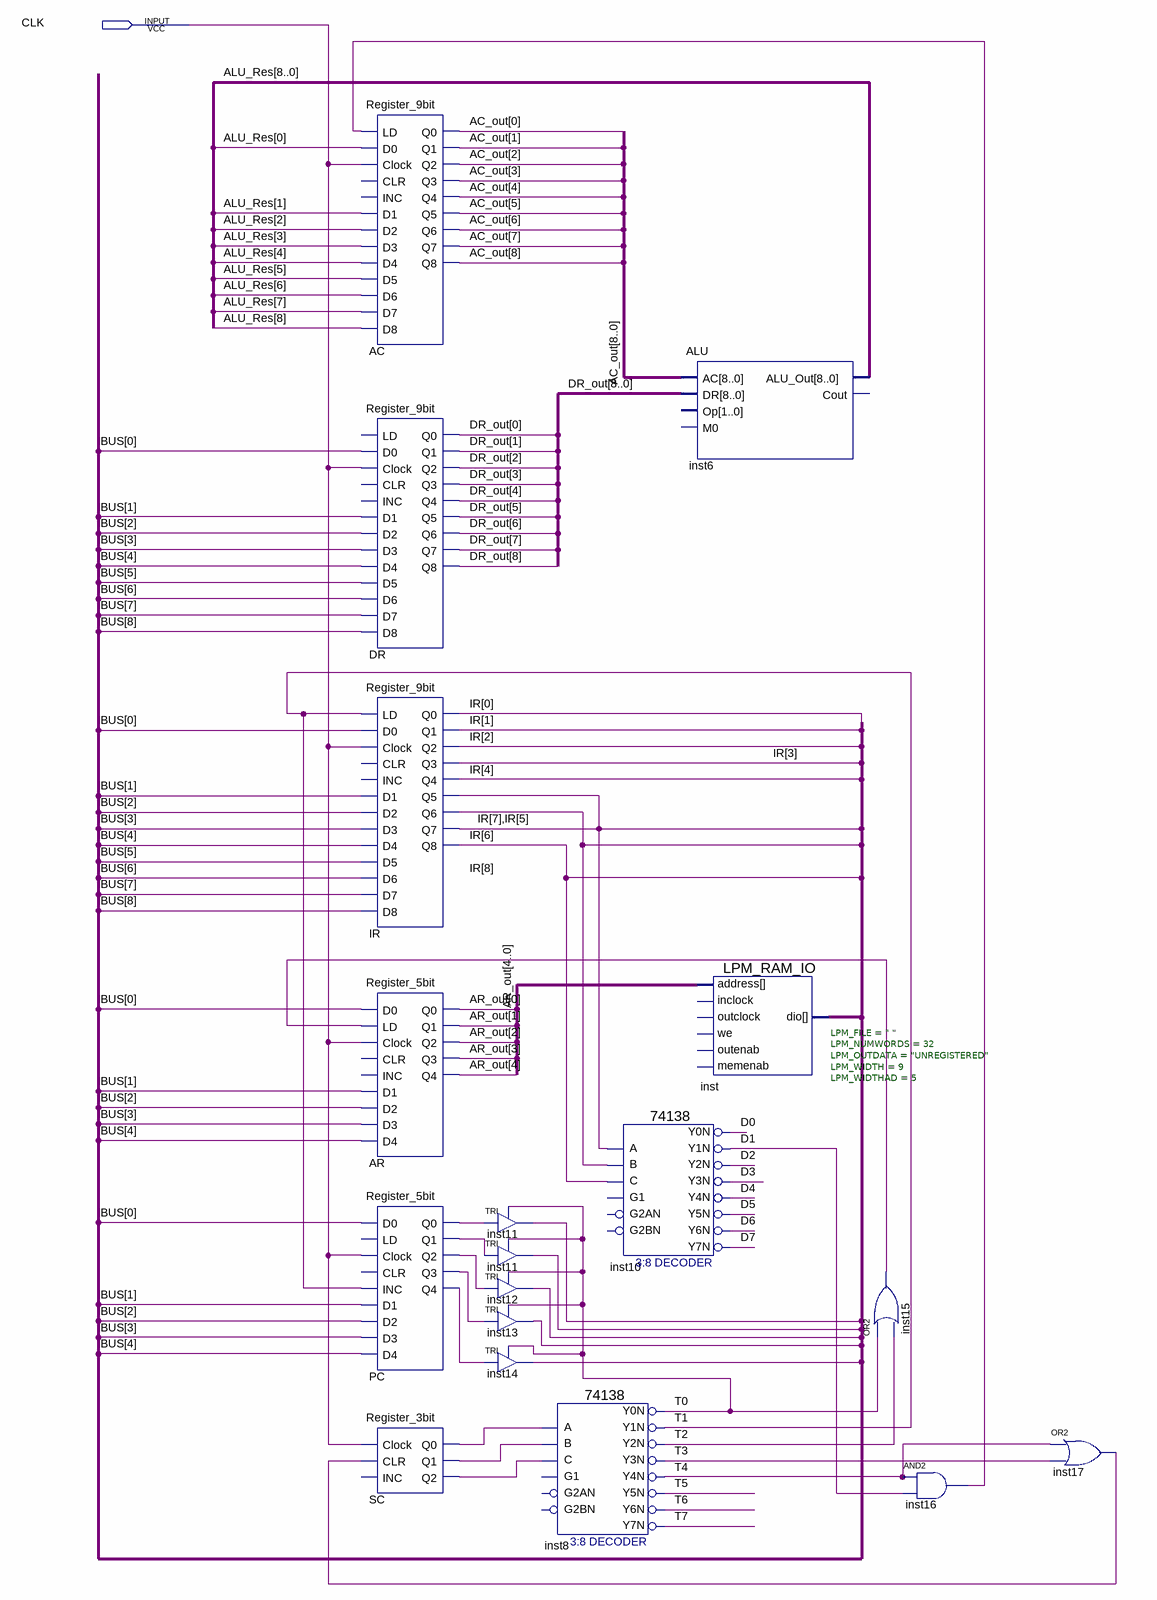
[diagram p0: schematic sheet]
// Quartus schematic MYB.bdf as structural Verilog: 18 symbols, 1 pins
module MYB (
  input  CLK
);

  wire D0, D1, D2, D3, D4, D5, D6, D7, inst11_out, inst11_out_2, inst12_out, inst13_out, inst14_out,
       inst15_out, inst16_out, inst17_out, PC_q0, PC_q1, PC_q2, PC_q3, PC_q4, SC_q0, SC_q1, SC_q2, T0, T1,
       T2, T3, T4, T5, T6, T7;
  wire [4:0] AR_out;
  wire [8:0] AC_out, ALU_Res, BUS, DR_out, inst_dio, IR;

  Register_9bit AC (
    .LD(inst16_out), .D0(ALU_Res[0]), .Clock(CLK), .D1(ALU_Res[1]), .D2(ALU_Res[2]), .D3(ALU_Res[3]),
    .D4(ALU_Res[4]), .D5(ALU_Res[5]), .D6(ALU_Res[6]), .D7(ALU_Res[7]), .D8(ALU_Res[8]), .Q0(AC_out[0]),
    .Q1(AC_out[1]), .Q2(AC_out[2]), .Q3(AC_out[3]), .Q4(AC_out[4]), .Q5(AC_out[5]), .Q6(AC_out[6]),
    .Q7(AC_out[7]), .Q8(AC_out[8]));  // open: CLR, INC
  Register_9bit DR (
    .D0(BUS[0]), .Clock(CLK), .D1(BUS[1]), .D2(BUS[2]), .D3(BUS[3]), .D4(BUS[4]), .D5(BUS[5]), .D6(BUS[6]),
    .D7(BUS[7]), .D8(BUS[8]), .Q0(DR_out[0]), .Q1(DR_out[1]), .Q2(DR_out[2]), .Q3(DR_out[3]), .Q4(DR_out[4]),
    .Q5(DR_out[5]), .Q6(DR_out[6]), .Q7(DR_out[7]), .Q8(DR_out[8]));  // open: LD, CLR, INC
  Register_9bit u_IR (
    .LD(T1), .D0(BUS[0]), .Clock(CLK), .D1(BUS[1]), .D2(BUS[2]), .D3(BUS[3]), .D4(BUS[4]), .D5(BUS[5]),
    .D6(BUS[6]), .D7(BUS[7]), .D8(BUS[8]), .Q0(IR[0]), .Q1(IR[1]), .Q2(IR[2]), .Q3(IR[3]), .Q4(IR[4]),
    .Q5({IR[7], IR[5]}), .Q6(IR[6]), .Q7({IR[7], IR[5]}), .Q8(IR[8]));  // open: CLR, INC
  Register_5bit AR (
    .D0(BUS[0]), .LD(inst15_out), .Clock(CLK), .D1(BUS[1]), .D2(BUS[2]), .D3(BUS[3]), .D4(BUS[4]),
    .Q0(AR_out[0]), .Q1(AR_out[1]), .Q2(AR_out[2]), .Q3(AR_out[3]), .Q4(AR_out[4]));  // open: CLR, INC
  Register_5bit PC (
    .D0(BUS[0]), .Clock(CLK), .INC(T1), .D1(BUS[1]), .D2(BUS[2]), .D3(BUS[3]), .D4(BUS[4]), .Q0(PC_q0),
    .Q1(PC_q1), .Q2(PC_q2), .Q3(PC_q3), .Q4(PC_q4));  // open: LD, CLR
  Register_3bit SC (.Clock(CLK), .CLR(inst17_out), .Q0(SC_q0), .Q1(SC_q1), .Q2(SC_q2));  // open: INC
  TRI inst11 (.IN(PC_q0), .OE(T0), .OUT(inst11_out_2));
  TRI inst11_dup2 (.IN(PC_q1), .OE(T0), .OUT(inst11_out));
  TRI inst12 (.IN(PC_q2), .OE(T0), .OUT(inst12_out));
  TRI inst13 (.IN(PC_q3), .OE(T0), .OUT(inst13_out));
  TRI inst14 (.IN(PC_q4), .OE(T0), .OUT(inst14_out));
  \74138  inst8 (
    .A(SC_q0), .B(SC_q1), .C(SC_q2), .Y0N(T0), .Y1N(T1), .Y2N(T2), .Y3N(T3), .Y4N(T4), .Y5N(T5), .Y6N(T6),
    .Y7N(T7));  // open: G1, G2AN, G2BN
  \74138  inst10 (
    .A({IR[7], IR[5]}), .B(IR[6]), .C(IR[8]), .Y0N(D0), .Y1N(D1), .Y2N(D2), .Y3N(D3), .Y4N(D4), .Y5N(D5),
    .Y6N(D6), .Y7N(D7));  // open: G1, G2AN, G2BN
  ALU inst6 (.AC(AC_out), .DR(DR_out), .ALU_Out(ALU_Res));  // open: Op, M0, Cout
  LPM_RAM_IO #(.LPM_FILE(" "), .LPM_NUMWORDS(32), .LPM_OUTDATA("UNREGISTERED"), .LPM_WIDTH(9), .LPM_WIDTHAD(5)) inst (
    .address(AR_out), .dio(inst_dio));  // open: outclock, memenab, inclock, we, outenab
  or inst15 (inst15_out, T0, T2);
  and inst16 (inst16_out, T4, D1);
  or inst17 (inst17_out, T4, T3);
endmodule
